# EAGLE design 555-rev2-smd-sparkfun (EAGLE 7.3.0)
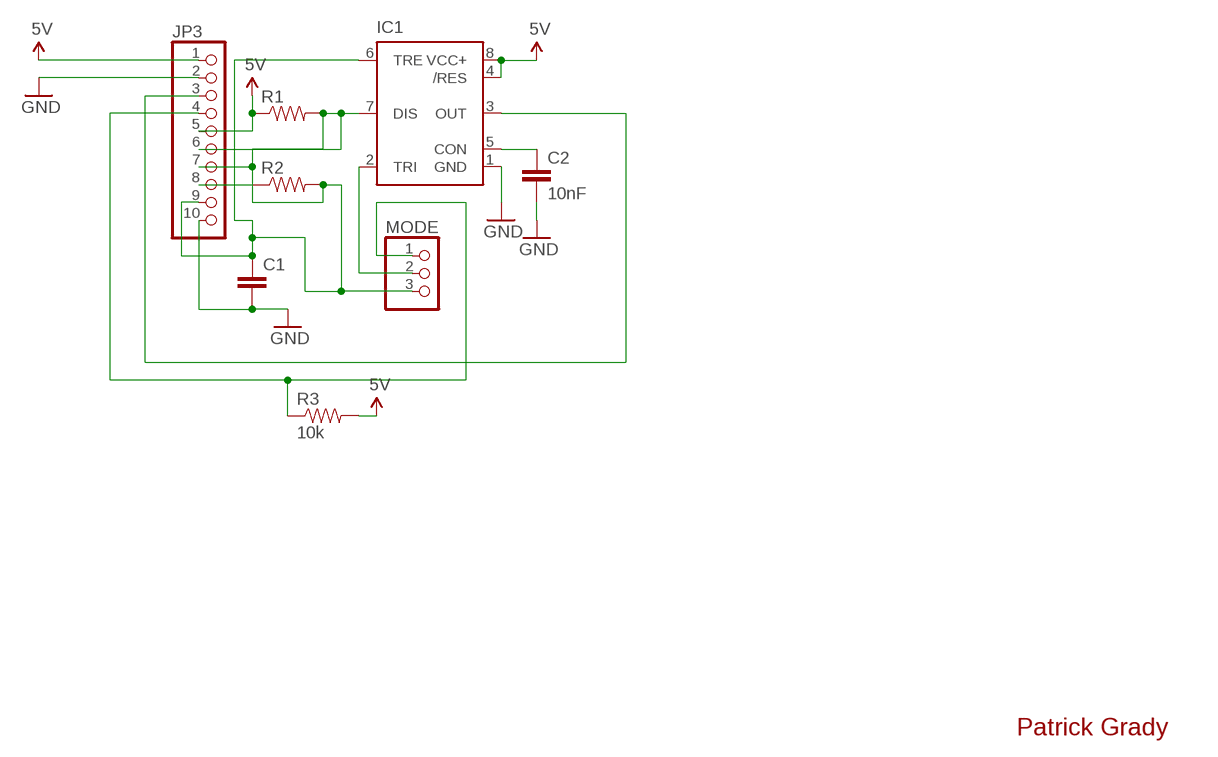
[diagram p0: schematic, sheet 1]

## Parts
C1  CAPEZ  [CAP-PTH-SMALLEZ]
C2  10nF  0.1UF-25V(+80/-20%)(0603)  [0603-CAP]
IC1  NE555D  [SO08]
JP3  PINHD-1X10  [1X10]
MODE  PINHD-1X3  [1X03]
R1  RESISTOREZ  [AXIAL-0.3EZ]
R2  RESISTOREZ  [AXIAL-0.3EZ]
R3  10k  RESISTOR0603-RES  [0603-RES]

## Nets
5V: IC1.4(/RES) IC1.8(VCC+) JP3.1 JP3.5 R1.P$1 R3.2
GND: C1.2 C2.2 IC1.1(GND) JP3.2 JP3.10
N$1: IC1.7(DIS) JP3.6 JP3.7 R1.P$2 R2.P$1
N$2: JP3.4 MODE.1 R3.1
N$3: C2.1 IC1.5(CON)
N$4: C1.1 IC1.6(TRE) JP3.8 JP3.9 MODE.3 R2.P$2
N$5: IC1.3(OUT) JP3.3
N$8: IC1.2(TRI) MODE.2

## Notes on the sheet
- Patrick Grady

## Library data of the parts
C1 = SparkFun-Passives:CAP: Capacitor Standard 0603 ceramic capacitor, and 0.1" leaded capacitor.
C2 = SparkFun-Capacitors:0.1UF-25V(+80/-20%)(0603): CAP-00810 Ceramic Standard decoupling cap; PROD_ID: CAP-00810; VALUE: 0.1uF
IC1 = SparkFun-AnalogIC:NE555: General purpose bipolar Timer
JP3 = pinhead:PINHD-1X10: PIN HEADER
MODE = pinhead:PINHD-1X3: PIN HEADER
R1-R3 = SparkFun-Passives:RESISTOR: Resistor Basic schematic elements and footprints for 0603, 1206, and PTH resistors.

## Board
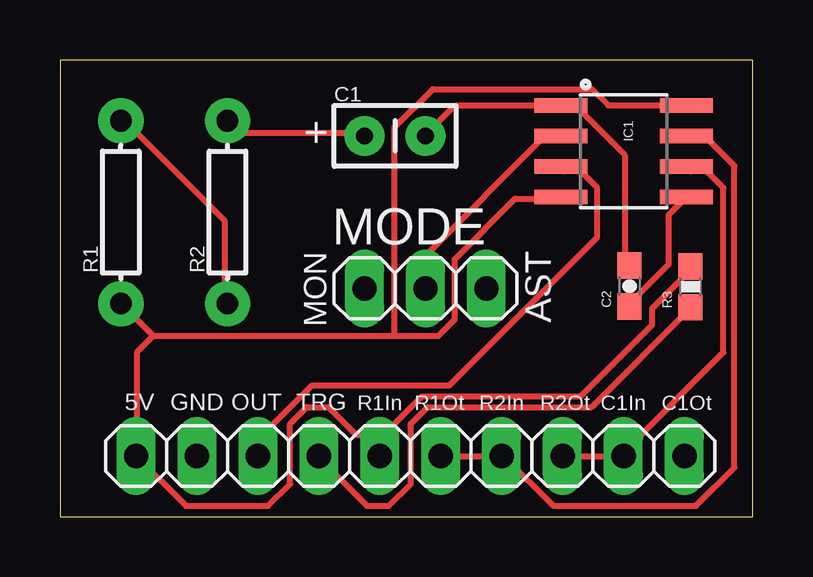
[diagram p1: board, top side]
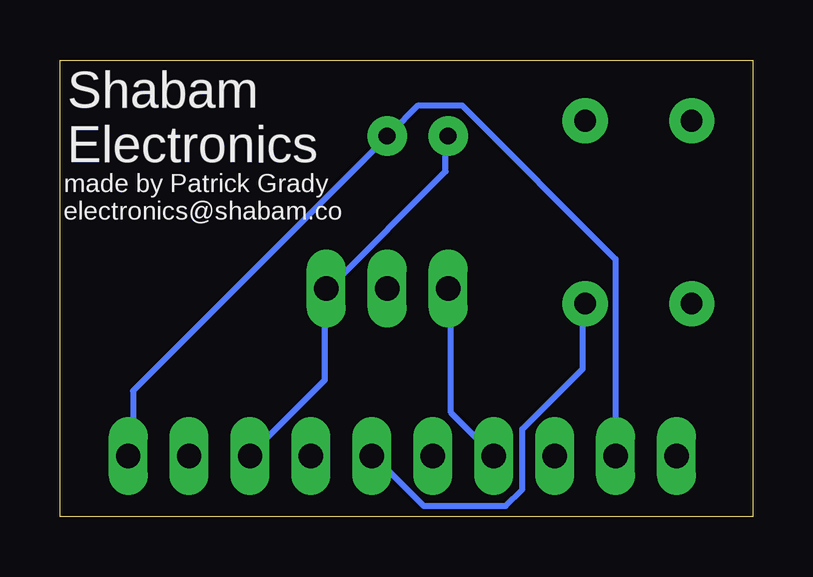
[diagram p2: board, bottom side, seen from below]

Size 28.88 x 19.04 mm. Coordinates in mm from the lower left corner, seen from the top.
Outline: 0,0 28.88,0 28.88,19.04 0,19.04 0,0
Copper layers (1*16): Top 0.035mm / dielectric 1.5mm / Bottom 0.035mm
Design rules "default *": minimum track width 10mil, minimum drill 20mil, track to track 8mil, track to pad 8mil, pad to pad 10mil, via to via 8mil, smd to smd 8mil, copper to edge 10mil, drill to drill 8mil, minimum pad ring 12mil, minimum via ring 10mil, stop-mask expansion 4mil, vias tented up to drill 25mil, thermal gap 10mil

### Footprints (pad centres in the part's own frame; a part is rotated, then mirrored left to right if it is on the bottom)
CAP-PTH-SMALLEZ = drill 0.7 pad 1.651: 1 0,0; 2 2.54,0
0603-CAP = smd 1.1 x 1: 1 -0.85,0; 2 0.85,0
SO08 = smd 0.61 x 2.21: 1 -1.905,-2.616; 2 -0.635,-2.616; 3 0.635,-2.616; 4 1.905,-2.616; 5 1.905,2.616; 6 0.635,2.616; 7 -0.635,2.616; 8 -1.905,2.616
1X10 = drill 1.016 long: 1 -11.43,0; 2 -8.89,0; 3 -6.35,0; 4 -3.81,0; 5 -1.27,0; 6 1.27,0; 7 3.81,0; 8 6.35,0; 9 8.89,0; 10 11.43,0
1X03 = drill 1.016 long: 1 -2.54,0; 2 0,0; 3 2.54,0
AXIAL-0.3EZ = drill 0.9 pad 1.88: P$1 -3.81,0; P$2 3.81,0
0603-RES = smd 1.1 x 1: 1 -0.85,0; 2 0.85,0

### Placement (x,y rotation side)
C1  12.7,15.88 0 top
C2  23.75,9.62 90 top
IC1  23.5,15.24 270 top
JP3  14.61,2.54 0 top
MODE  15.24,9.53 0 top
R1  2.54,12.7 90 top
R2  6.99,12.7 90 top
R3  26.29,9.59 90 top

### Tracks (layer width: path | path; a pad name or v marks a point on that pad's centre or on a via)
5V
  Top 0.254: 13.49,3.43 15.09,5.03 21.72,5.03 24.69,8 24.69,8.69 26.29,10.29 R3.2 | 13.49,3.43 13.49,2.74 JP3.5 13.49,3.43 | 3.89,7.54 13.95,7.54 | 13.95,7.54 15.77,7.54 16.46,8.23 16.46,10.74 18.97,13.26 20.8,13.26 IC1.4 | R1.P$1 3.89,7.54 | IC1.8 22.86,17.14 22.17,17.83 15.54,17.83 13.95,16.23 13.95,7.54 | 3.89,7.54 3.2,6.86 3.2,2.74 JP3.1 5.26,0.46 8.69,0.46 9.6,1.37 9.6,3.89 10.29,4.57 11.2,4.57 12.34,3.43 13.49,3.43
GND
  Top 0.254: C2.2 23.55,10.52 23.55,15.09 21.49,17.14 IC1.1 16.46,17.14 15.32,16 C1.2
  Bottom 0.254: JP3.2 5.71,10.74 12.12,17.14 13.95,17.14 15.09,16 C1.2 15.32,15.77 25.83,5.26 25.83,2.74 JP3.10
N$1
  Top 0.254: R2.P$1 6.86,8.91 6.86,12.34 2.74,16.46 R1.P$2 | IC1.7 26.29,15.77 26.98,15.77 28.12,14.63 28.12,2.06 26.52,0.46 20.57,0.46 18.52,2.52 JP3.7 18.29,2.52 16,2.52 JP3.6
  Bottom 0.254: R2.P$1 7.09,8.69 7.09,6.17 9.6,3.66 9.6,1.14 10.29,0.46 13.72,0.46 15.77,2.52 JP3.6
N$2
  Top 0.254: R3.1 26.29,8.69 22.17,4.57 15.32,4.57 14.63,3.89 14.63,1.37 13.72,0.46 12.8,0.46 10.74,2.52 JP3.4
  Bottom 0.254: MODE.1 12.57,9.37 12.57,4.34 10.97,2.74 JP3.4
N$3
  Top 0.254: C2.1 23.77,8.91 25.38,10.52 25.38,12.57 26.06,13.26 IC1.5
N$4
  Top 0.254: C1.1 12.57,16 7.54,16 7.09,16.46 R2.P$2 | IC1.6 26.29,14.4 26.98,14.4 27.66,13.72 27.66,6.86 23.55,2.74 JP3.9 23.32,2.52 21.03,2.52 JP3.8
  Bottom 0.254: JP3.8 20.8,2.74 17.83,5.71 17.83,9.37 MODE.3 17.6,9.6 12.8,14.4 12.8,15.77 C1.1
N$5
  Top 0.254: IC1.3 21.03,14.4 21.72,14.4 22.4,13.72 22.4,11.66 16.23,5.49 10.52,5.49 8.46,3.43 8.46,2.74 JP3.3
N$8
  Top 0.254: IC1.2 20.8,15.77 20.12,15.77 15.32,10.97 15.32,9.6 MODE.2

### Text on the board
tPlace: + | MON | AST | TRG
bPlace: Shabam / Electronics | made by Patrick Grady / electronics@shabam.co
tNames: 5V | GND | OUT | R1In | R1Ot | R2In | R2Ot | C1In | C1Ot